# Altium project main_pcb.PrjPcb
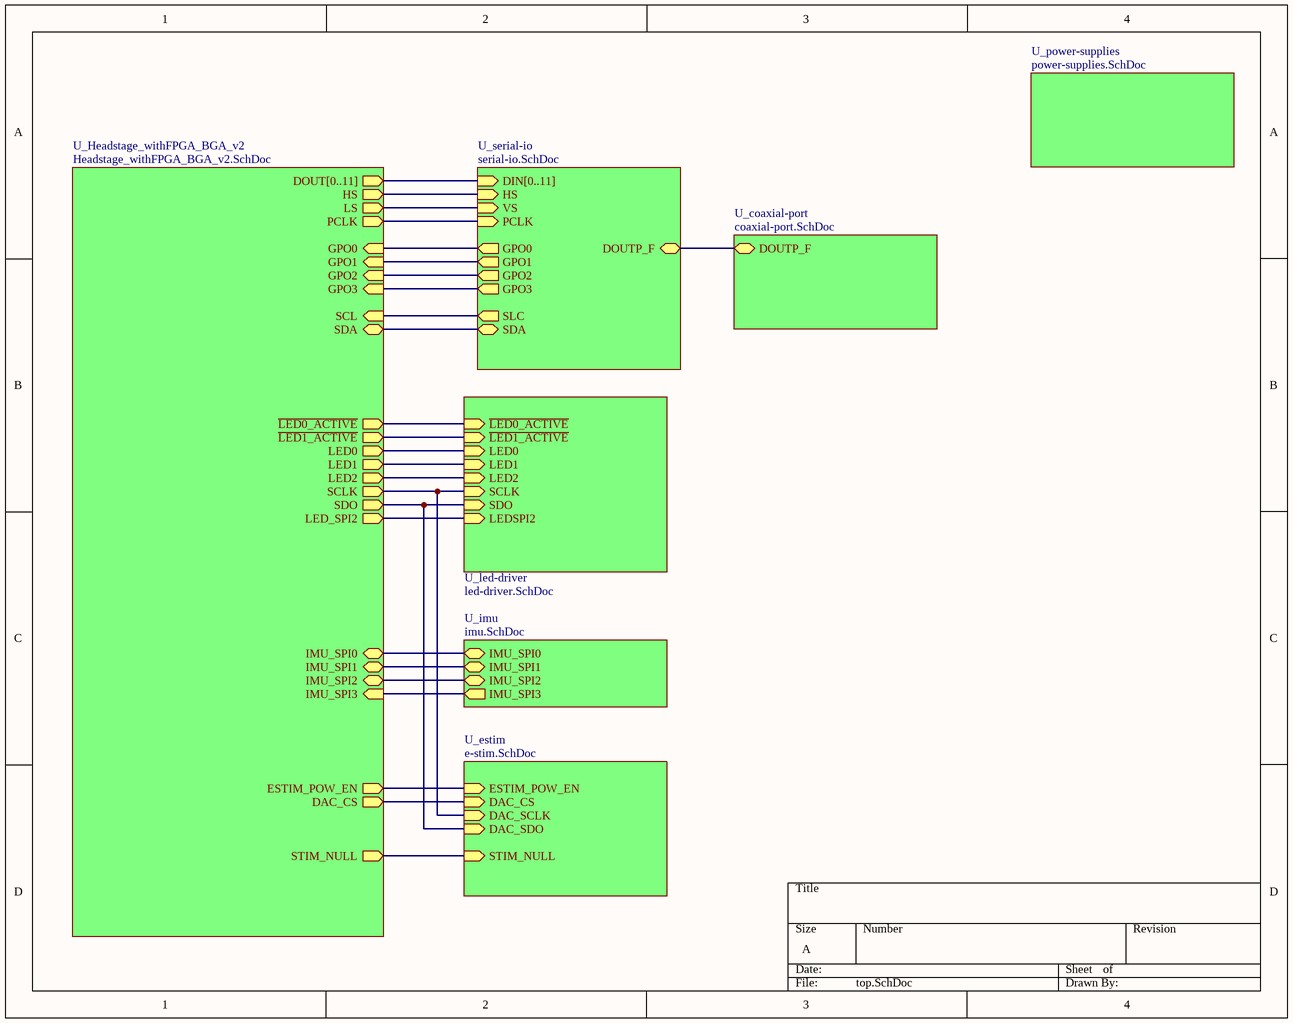
[diagram p0: top.SchDoc]
7 sheets, 112 parts. Net scope: hierarchical (ports join the sheet entries above them; power ports are global).
Board file: serdes-interface.PcbDoc
Sheets:
  top.SchDoc
    U_coaxial-port = coaxial-port.SchDoc
    U_power-supplies = power-supplies.SchDoc
    U_serial-io = serial-io.SchDoc
    U_led-driver = led-driver.SchDoc
    U_imu = imu.SchDoc
    U_estim = e-stim.SchDoc

## Sheet top.SchDoc
size A

### Sub-sheets
U_coaxial-port = coaxial-port.SchDoc: DOUTP_F (bidir)
U_estim = e-stim.SchDoc: ESTIM_POW_EN (in), DAC_CS (in), DAC_SCLK (in), DAC_SDO (in), STIM_NULL (in)
U_Headstage_withFPGA_BGA_v2 = Headstage_withFPGA_BGA_v2.SchDoc (file not in this document): DOUT[0..11] (out), HS (out), LS (out), PCLK (out), GPO3 (in), GPO2 (in), GPO1 (in), SDA (bidir), SCL (in), GPO0 (in), ~{LED0_ACTIVE} (out), ~{LED1_ACTIVE} (out), LED0 (out), LED1 (out), LED2 (out), SCLK (out), SDO (out), LED_SPI2 (out), IMU_SPI0 (bidir), IMU_SPI1 (bidir), IMU_SPI2 (bidir), IMU_SPI3 (in), ESTIM_POW_EN (out), DAC_CS (out), STIM_NULL (out)
U_imu = imu.SchDoc: IMU_SPI0 (bidir), IMU_SPI1 (bidir), IMU_SPI2 (bidir), IMU_SPI3 (out)
U_led-driver = led-driver.SchDoc: ~{LED0_ACTIVE} (in), ~{LED1_ACTIVE} (in), SCLK (in), LED0 (in), LED1 (in), LED2 (in), SDO (in), LEDSPI2 (in)
U_power-supplies = power-supplies.SchDoc: no entries
U_serial-io = serial-io.SchDoc: DIN[0..11] (in), HS (in), VS (in), PCLK (in), DOUTP_F (bidir), SDA (bidir), SLC (out), GPO0 (out), GPO1 (out), GPO2 (out), GPO3 (out)

### Nets
IMU_SPI0: sheet U_Headstage_withFPGA_BGA_v2/IMU_SPI0, sheet U_imu/IMU_SPI0
IMU_SPI1: sheet U_Headstage_withFPGA_BGA_v2/IMU_SPI1, sheet U_imu/IMU_SPI1
IMU_SPI2: sheet U_Headstage_withFPGA_BGA_v2/IMU_SPI2, sheet U_imu/IMU_SPI2
IMU_SPI3: sheet U_Headstage_withFPGA_BGA_v2/IMU_SPI3, sheet U_imu/IMU_SPI3
LED0: sheet U_Headstage_withFPGA_BGA_v2/LED0, sheet U_led-driver/LED0
LED1: sheet U_Headstage_withFPGA_BGA_v2/LED1, sheet U_led-driver/LED1
LED2: sheet U_Headstage_withFPGA_BGA_v2/LED2, sheet U_led-driver/LED2
LEDSPI2: sheet U_Headstage_withFPGA_BGA_v2/LED_SPI2, sheet U_led-driver/LEDSPI2
NetC18_1: sheet U_coaxial-port/DOUTP_F, sheet U_serial-io/DOUTP_F
NetDAC1_1: sheet U_Headstage_withFPGA_BGA_v2/DAC_CS, sheet U_estim/DAC_CS
NetDAC1_2: sheet U_Headstage_withFPGA_BGA_v2/SCLK, sheet U_led-driver/SCLK, sheet U_estim/DAC_SCLK
NetDAC1_3: sheet U_Headstage_withFPGA_BGA_v2/SDO, sheet U_led-driver/SDO, sheet U_estim/DAC_SDO
NetLD1_21: sheet U_Headstage_withFPGA_BGA_v2/~{LED0_ACTIVE}, sheet U_led-driver/~{LED0_ACTIVE}
NetLD2_21: sheet U_Headstage_withFPGA_BGA_v2/~{LED1_ACTIVE}, sheet U_led-driver/~{LED1_ACTIVE}
NetPWR15_8: sheet U_Headstage_withFPGA_BGA_v2/ESTIM_POW_EN, sheet U_estim/ESTIM_POW_EN
NetR7_1: sheet U_serial-io/SDA, sheet U_Headstage_withFPGA_BGA_v2/SDA
NetR8_1: sheet U_serial-io/SLC, sheet U_Headstage_withFPGA_BGA_v2/SCL
NetR46_2: sheet U_Headstage_withFPGA_BGA_v2/STIM_NULL, sheet U_estim/STIM_NULL
NetU9_1: sheet U_serial-io/HS, sheet U_Headstage_withFPGA_BGA_v2/HS
NetU9_2: sheet U_serial-io/VS, sheet U_Headstage_withFPGA_BGA_v2/LS
NetU9_3: sheet U_serial-io/PCLK, sheet U_Headstage_withFPGA_BGA_v2/PCLK
NetU9_15: sheet U_serial-io/GPO0, sheet U_Headstage_withFPGA_BGA_v2/GPO0
NetU9_16: sheet U_serial-io/GPO1, sheet U_Headstage_withFPGA_BGA_v2/GPO1
NetU9_17: sheet U_serial-io/GPO2, sheet U_Headstage_withFPGA_BGA_v2/GPO2
NetU9_18: sheet U_serial-io/GPO3, sheet U_Headstage_withFPGA_BGA_v2/GPO3

### Buses and harness runs
bus sheet U_Headstage_withFPGA_BGA_v2/DOUT[0..11] = sheet U_serial-io/DIN[0..11]

## Sheet coaxial-port.SchDoc
size A
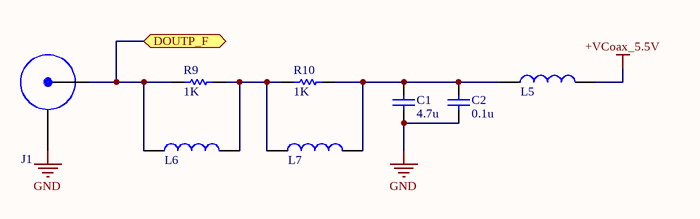
[diagram p1: coaxial-port.SchDoc]

### Parts
C1  value 4.7u  [Cap-0603]  (hidden comment: X7R Ceramic)
C2  value 0.1u  [Cap-0603]  (hidden comment: X7R Ceramic)
J1  Coax Connector  [SMA_132134-10-ND]  (value not drawn)
L5  Ferrite Bead  [BLM18KG601SN1D]  (value not drawn)
L6  Ferrite Bead  [CIG21L4R7MNE]  (value not drawn)
L7  Ferrite Bead  [CBC3225T101MR]  (value not drawn)
R9  value 1K  [Res_0402]  (hidden comment: Res1)
R10  value 1K  [Res_0402]  (hidden comment: Res1)

### Ports
DOUTP_F (bidir)

### Nets
+VCoax_5.5V: L5.2
GND: C1.1 C2.1 J1.1
NetC1_2: C1.2 C2.2 L5.1 L7.2 R10.1
NetC18_1: J1.0 L6.1 R9.2 ; port DOUTP_F
NetL6_2: L6.2 L7.1 R9.1 R10.2

### Library data of the parts
C1 C2 = Cap: Capacitor; Published: 8-Jun-2000; LatestRevisionDate: 17-Jul-2002; LatestRevisionNote: Re-released for DXP Platform.; PackageReference: RAD-0.3; Publisher: Altium Limited; PackageDescription: Radial Cap, Thru-Hole; 2 Leads; 0.3 in Pin Spacing
R9 R10 = Res1: Resistor; Published: 8-Jun-2000; LatestRevisionDate: 17-Jul-2002; LatestRevisionNote: Re-released for DXP Platform.; PackageReference: AXIAL-0.3; Publisher: Altium Limited; PackageDescription: Axial Device, Thru-Hole; 2 Leads; 0.3 in Pin Spacing

## Sheet power-supplies.SchDoc
size B
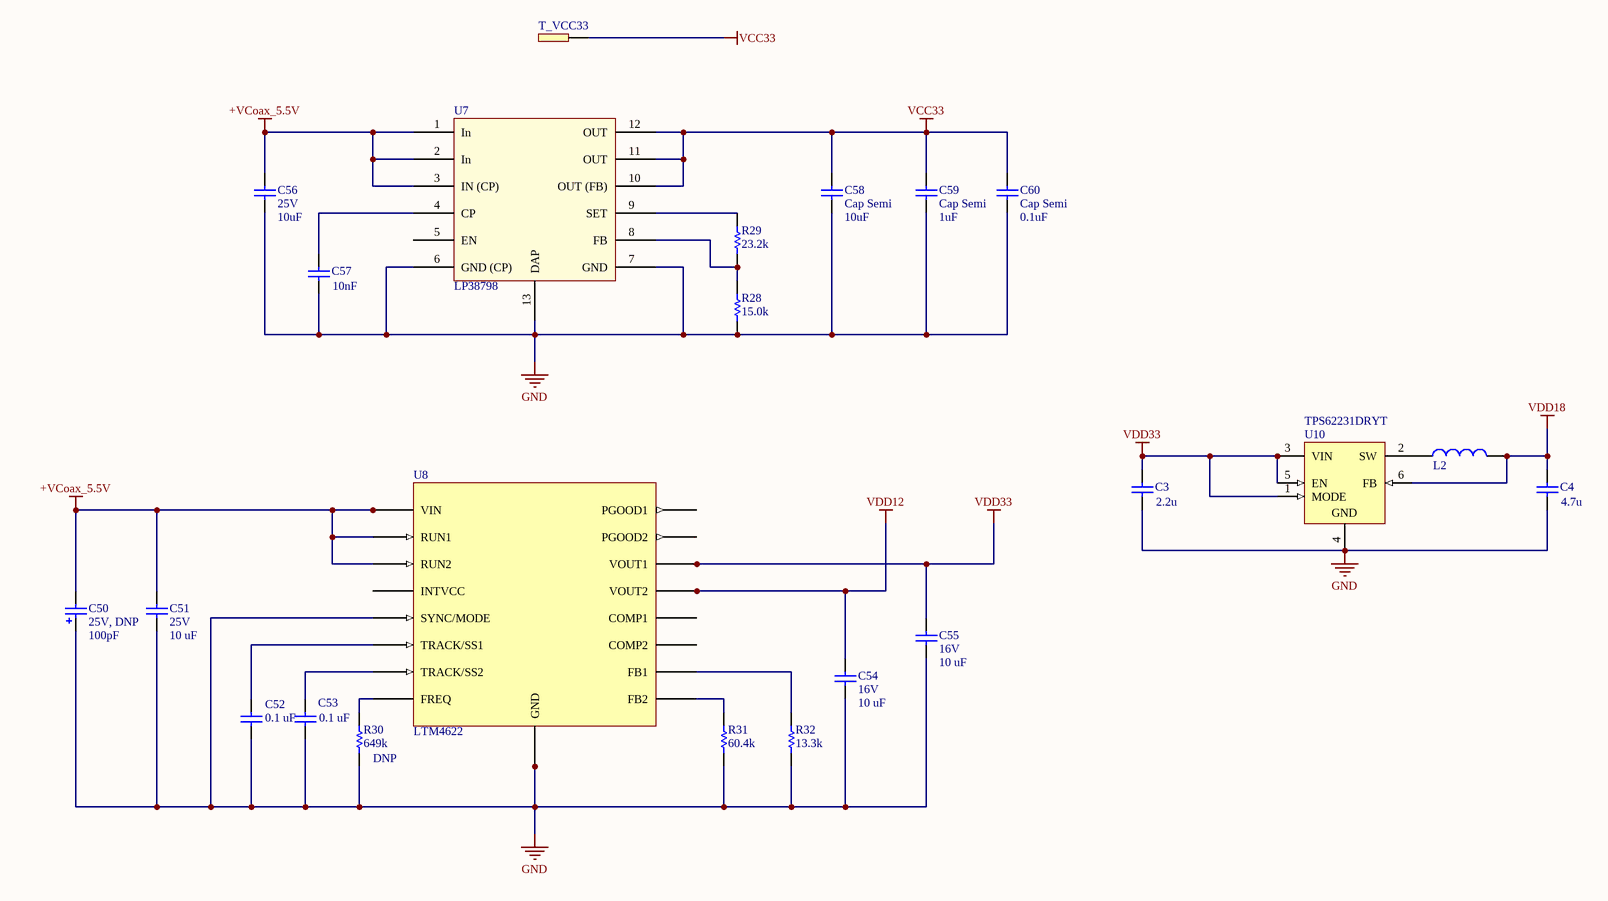
[diagram p2: power-supplies.SchDoc]

### Parts
C3  value 2.2u  [Cap_0402]  (hidden comment: X7R Ceramic)
C4  value 4.7u  [Cap_0402]  (hidden comment: X7R Ceramic)
C50  25V, DNP  value 100pF  [C0805]
C51  25V  value 10 uF  [C1206]
C52  value 0.1 uF  [C1206]  (hidden comment: 25V)
C53  value 0.1 uF  [C1206]  (hidden comment: 25V)
C54  16V  value 10 uF  [C1206]
C55  16V  value 10 uF  [C1206]
C56  25V  value 10uF  [C1206]
C57  value 10nF  [0402]
C58  Cap Semi  value 10uF  [Cap-0603]
C59  Cap Semi  value 1uF  [Cap-0603]
C60  Cap Semi  value 0.1uF  [Cap-0603]
L2  Ferrite Bead  [LQM21PN2R2MC0D]  (value not drawn)
R28  value 15.0k  [Res_0402]  (hidden comment: Res1)
R29  value 23.2k  [Res_0402]  (hidden comment: Res1)
R30  DNP  value 649k  [Res_0402]
R31  value 60.4k  [Res_0402]  (hidden comment: 649k (DNP))
R32  value 13.3k  [Res_0402]
T_VCC33  Header_1PIN  [JUMPER1PIN]  (value not drawn)
U7  LP38798  [DFN12]
U8  LTM4622  [LGA5x5]
U10  TPS62231DRYT  [TPS62231DRYT]

### Nets
+VCoax_5.5V: C50.2 C51.2 C56.2 U7.1(In) U7.2(In) U7.3(IN_(CP)) U8.A2(VIN) U8.B2(RUN2) U8.B3(VIN) U8.D2(RUN1) U8.D3(VIN) U8.E2(VIN)
GND: C3.1 C4.1 C50.1 C51.1 C52.1 C53.1 C54.1 C55.1 C56.1 C57.1 C58.1 C59.1 C60.1 R28.2 R30.2 R31.2 R32.2 U7.6(GND_(CP)) U7.7(GND) U7.13(DAP) U8.B5(GND) U8.C1(GND) U8.C2(GND) U8.C5(SYNC/MODE) U8.D5(GND) U10.4(GND)
VCC33: C58.2 C59.2 C60.2 T_VCC33.0 U7.10(OUT_(FB)) U7.11(OUT) U7.12(OUT)
VDD12: C54.2 U8.A1(VOUT2) U8.B1(VOUT2)
VDD18: C4.2 L2.2 U10.6(FB)
VDD33: C3.2 C55.2 U8.D1(VOUT1) U8.E1(VOUT1) U10.1(MODE) U10.3(VIN) U10.5(EN)
NetC52_2: C52.2 U8.E5(TRACK/SS1)
NetC53_2: C53.2 U8.A3(TRACK/SS2)
NetC57_2: C57.2 U7.4(CP)
NetL2_1: L2.1 U10.2(SW)
NetR28_1: R28.1 R29.2 U7.8(FB)
NetR29_1: R29.1 U7.9(SET)
NetR30_1: R30.1 U8.C4(FREQ)
NetR31_1: R31.1 U8.A4(FB2)
NetR32_1: R32.1 U8.E4(FB1)

Not connected (* = marked no-connect by the designer): U7 5(EN); U8 A5(COMP2) B4(PGOOD2) C3(INTVCC) D4(PGOOD1)

### Library data of the parts
C3 C4 = Cap: Capacitor; Published: 8-Jun-2000; LatestRevisionDate: 17-Jul-2002; LatestRevisionNote: Re-released for DXP Platform.; PackageReference: RAD-0.3; Publisher: Altium Limited; PackageDescription: Radial Cap, Thru-Hole; 2 Leads; 0.3 in Pin Spacing
C50 = Cap Pol3: Polarized Capacitor (Surface Mount); Published: 8-Jun-2000; LatestRevisionDate: 29-May-2009; LatestRevisionNote: IPC-7351 Footprint Added.; PackageReference: C0805; Publisher: Altium Limited; PackageDescription: Chip Capacitor
C51-C60 = Cap Semi: Capacitor (Semiconductor SIM Model); Published: 8-Jun-2000; LatestRevisionDate: 29-May-2009; LatestRevisionNote: IPC-7351 Footprint Added.; PackageReference: C1206; Publisher: Altium Limited; PackageDescription: Chip Capacitor
  C51-C53: Voltage: 25 V
  C54 C55: Voltage: 16 V
R28-R32 = Res1: Resistor; Published: 8-Jun-2000; LatestRevisionDate: 17-Jul-2002; LatestRevisionNote: Re-released for DXP Platform.; PackageReference: AXIAL-0.3; Publisher: Altium Limited; PackageDescription: Axial Device, Thru-Hole; 2 Leads; 0.3 in Pin Spacing
U7 = Component_1: Low Noise Positive LDO
U10 = TPS62231DRYT: Buck Step Down Regulator with 2.05 to 6 V Input and 1.8 V Output, -40 to 85 degC, 6-Pin SON (DRY), Green (RoHS & no Sb/Br); Manufacturer: Texas Instruments; Duty Cycle(Max)(%): 100; Iout(Max)(A): 0.5; Iq(Typ)(mA): 0.022; Preset Vout(V): 1.8; Rating: Catalog; Regulated Outputs(#): 1; SubFamily: Step-Down Regulator; Switch Current Limit(Typ)(A): 0.84; Synchronous Rectification: TRUE; Vin(Max)(V): 6; Vin(Min)(V): 2.05; DatasheetVersion: SLVS941E; PackageVersion: revF, Dec-2011; PackageReference: DRY6; PackageDescription: 6-Pin Plastic Small Outline No-Lead, 1 x 1.45 x 0.6 mm Body, 0.5 mm Pitch; Supplier 1: Digi-Key; Supplier Part Number 1: 296-24485-2-ND; Supplier 2: Digi-Key; Supplier Part Number 2: 296-24485-1-ND; Supplier 3: Digi-Key; Supplier Part Number 3: 296-24485-6-ND; Supplier 4: Farnell; Supplier Part Number 4: 1735598; Supplier 5: Newark; Supplier Part Number 5: 07R8108; Supplier 6: Mouser; Supplier Part Number 6: 595-TPS62231DRYT; Eco-Plan: Green (RoHS & no Sb/Br); Topology: Buck; Vout(Max)(V): 1.8; Vout(Min)(V): 1.8; Mounting Technology: Surface Mount; PartNumber: TPS62231DRYT; ComponentLink1Description: Datasheet; ComponentLink1URL: http://www.ti.com/general/docs/lit/getliterature.tsp?genericPartNumber=TPS62231&fileType=pdf; ComponentLink2Description: Package Specification; ComponentLink2URL: http://www.ti.com/litv/pdf/mpds221e; ComponentLink3Description: URL Link1; ComponentLink3URL: Samples URL:http://www.ti.com/product/tps62231#samples

## Sheet serial-io.SchDoc
size A
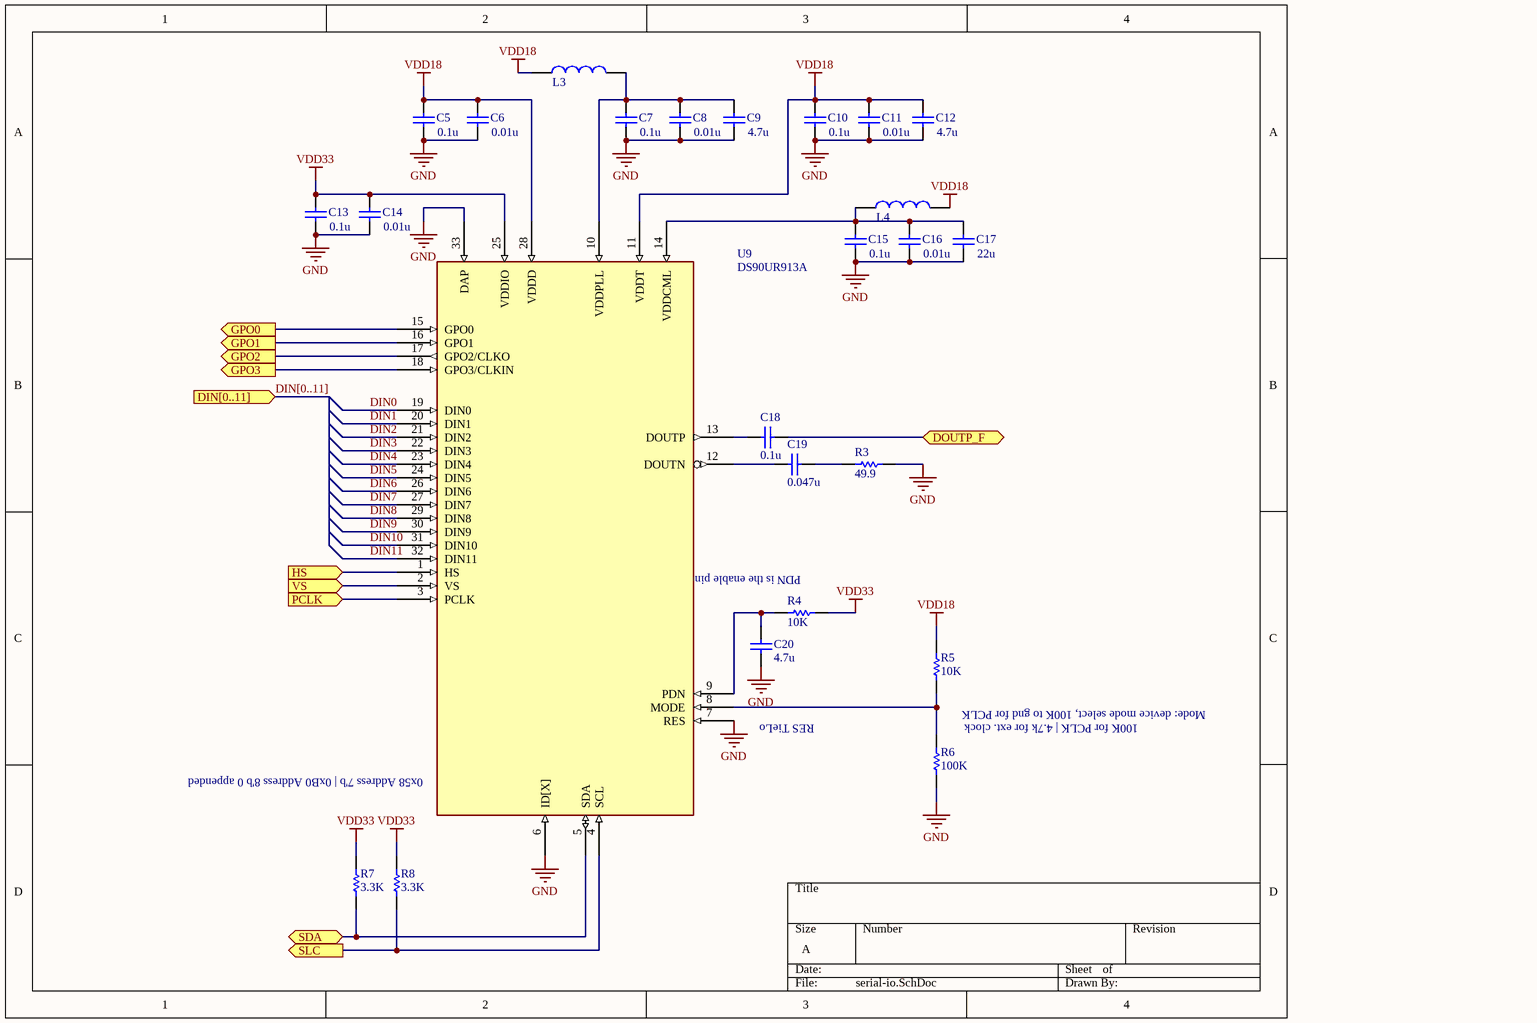
[diagram p3: serial-io.SchDoc]

### Parts
C5  value 0.1u  [Cap_0402]  (hidden comment: X7R Ceramic)
C6  value 0.01u  [Cap_0402]  (hidden comment: X7R Ceramic)
C7  value 0.1u  [Cap_0402]  (hidden comment: X7R Ceramic)
C8  value 0.01u  [Cap_0402]  (hidden comment: X7R Ceramic)
C9  value 4.7u  [Cap_0402]  (hidden comment: X7R Ceramic)
C10  value 0.1u  [Cap_0402]  (hidden comment: X7R Ceramic)
C11  value 0.01u  [Cap_0402]  (hidden comment: X7R Ceramic)
C12  value 4.7u  [Cap_0402]  (hidden comment: X7R Ceramic)
C13  value 0.1u  [Cap_0402]  (hidden comment: X7R Ceramic)
C14  value 0.01u  [Cap_0402]  (hidden comment: X7R Ceramic)
C15  value 0.1u  [Cap_0402]  (hidden comment: X7R Ceramic)
C16  value 0.01u  [Cap_0402]  (hidden comment: X7R Ceramic)
C17  value 22u  [Cap-0603]  (hidden comment: X7R Ceramic)
C18  value 0.1u  [Cap_0402]  (hidden comment: X7R Ceramic)
C19  value 0.047u  [Cap_0402]  (hidden comment: X7R Ceramic)
C20  value 4.7u  [Cap_0402]  (hidden comment: X7R Ceramic)
L3  Ferrite Bead  [BLM18KG601SN1D]  (value not drawn)
L4  Ferrite Bead  [BLM18KG601SN1D]  (value not drawn)
R3  value 49.9  [Res_0402]  (hidden comment: Res1)
R4  value 10K  [Res_0402]  (hidden comment: Res1)
R5  value 10K  [Res_0402]  (hidden comment: Res1)
R6  value 100K  [Res_0402]  (hidden comment: Res1)
R7  value 3.3K  [Res_0402]  (hidden comment: Res1)
R8  value 3.3K  [Res_0402]  (hidden comment: Res1)
U9  DS90UR913A  [WQFN32-DS90UB913A]

### Ports
DIN[0..11] (in), DOUTP_F (bidir), GPO0 (out), GPO1 (out), GPO2 (out), GPO3 (out), HS (in), PCLK (in), SDA (bidir), SLC (out), VS (in)

### Nets
GND: C5.1 C6.1 C7.1 C8.1 C9.1 C10.1 C11.1 C12.1 C13.1 C14.1 C15.1 C16.1 C17.1 C20.1 R3.2 R6.1 U9.6(ID[X]) U9.7(RES) U9.33(DAP)
VDD18: C5.2 C6.2 C10.2 C11.2 C12.2 L3.1 L4.2 R5.2 U9.11(VDDT) U9.28(VDDD)
VDD33: C13.2 C14.2 R4.2 R7.2 R8.2 U9.25(VDDIO)
DIN0: U9.19(DIN0)
DIN1: U9.20(DIN1)
DIN2: U9.21(DIN2)
DIN3: U9.22(DIN3)
DIN4: U9.23(DIN4)
DIN5: U9.24(DIN5)
DIN6: U9.26(DIN6)
DIN7: U9.27(DIN7)
DIN8: U9.29(DIN8)
DIN9: U9.30(DIN9)
DIN10: U9.31(DIN10)
DIN11: U9.32(DIN11)
NetC7_2: C7.2 C8.2 C9.2 L3.2 U9.10(VDDPLL)
NetC15_2: C15.2 C16.2 C17.2 L4.1 U9.14(VDDCML)
NetC18_1: C18.1 ; port DOUTP_F
NetC18_2: C18.2 U9.13(DOUTP)
NetC19_1: C19.1 R3.1
NetC19_2: C19.2 U9.12(DOUTN)
NetC20_2: C20.2 R4.1 U9.9(PDN)
NetR5_1: R5.1 R6.2 U9.8(MODE)
NetR7_1: R7.1 U9.5(SDA) ; port SDA
NetR8_1: R8.1 U9.4(SCL) ; port SLC
NetU9_1: U9.1(HS) ; port HS
NetU9_2: U9.2(VS) ; port VS
NetU9_3: U9.3(PCLK) ; port PCLK
NetU9_15: U9.15(GPO0) ; port GPO0
NetU9_16: U9.16(GPO1) ; port GPO1
NetU9_17: U9.17(GPO2/CLKO) ; port GPO2
NetU9_18: U9.18(GPO3/CLKIN) ; port GPO3

### Buses and harness runs
bus DIN[0..11] = port DIN[0..11]

### Notes on the sheet
- (near U9) PDN is the enable pin
- Mode: device mode select, 100K to gnd for PCLK
- (near U9) 0x58 Address 7'b | 0xB0 Address 8'b 0 appended
- RES TieLo
- (near R6) 100K for PCLK | 4.7k for ext. clock

### Library data of the parts
C5-C20 = Cap: Capacitor; Published: 8-Jun-2000; LatestRevisionDate: 17-Jul-2002; LatestRevisionNote: Re-released for DXP Platform.; PackageReference: RAD-0.3; Publisher: Altium Limited; PackageDescription: Radial Cap, Thru-Hole; 2 Leads; 0.3 in Pin Spacing
R3-R8 = Res1: Resistor; Published: 8-Jun-2000; LatestRevisionDate: 17-Jul-2002; LatestRevisionNote: Re-released for DXP Platform.; PackageReference: AXIAL-0.3; Publisher: Altium Limited; PackageDescription: Axial Device, Thru-Hole; 2 Leads; 0.3 in Pin Spacing
U9 = DS90UR913A: DS90UR913ASERIALIZER

## Sheet led-driver.SchDoc
size A
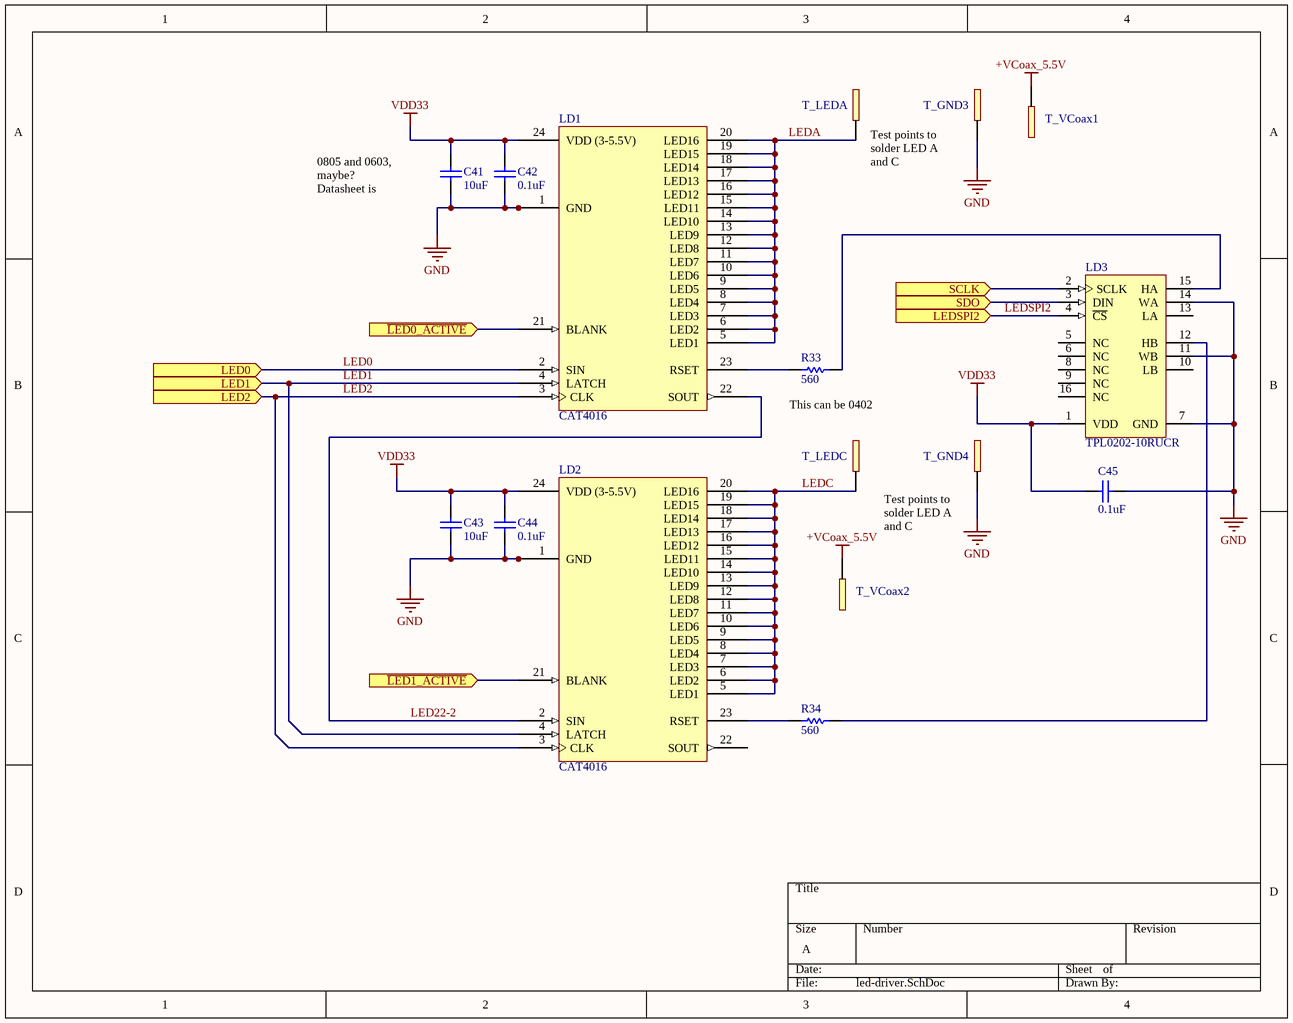
[diagram p4: led-driver.SchDoc]

### Parts
C41  value 10uF  [Cap-0603]  (hidden comment: Cap)
C42  value 0.1uF  [Cap_0402]  (hidden comment: Cap)
C43  value 10uF  [Cap-0603]  (hidden comment: Cap)
C44  value 0.1uF  [Cap_0402]  (hidden comment: Cap)
C45  value 0.1uF  [Cap_0402]  (hidden comment: Cap)
LD1  CAT4016  [TQFN24-4x4mm]
LD2  CAT4016  [TQFN24-4x4mm]
LD3  TPL0202-10RUCR  [WQFN16-3X3mm]
R33  value 560  [Res_0402]  (hidden comment: Res1)
R34  value 560  [Res_0402]  (hidden comment: Res1)
T_GND3  Header_1PIN  [JUMPER1PIN]  (value not drawn)
T_GND4  Header_1PIN  [JUMPER1PIN]  (value not drawn)
T_LEDA  Header_1PIN  [JUMPER1PIN]  (value not drawn)
T_LEDC  Header_1PIN  [JUMPER1PIN]  (value not drawn)
T_VCoax1  Header_1PIN  [JUMPER1PIN]  (value not drawn)
T_VCoax2  Header_1PIN  [JUMPER1PIN]  (value not drawn)

### Ports
LED0 (in), LED1 (in), LED2 (in), LEDSPI2 (in), SCLK (in), SDO (in), ~{LED0_ACTIVE} (in), ~{LED1_ACTIVE} (in)

### Nets
+VCoax_5.5V: T_VCoax1.0 T_VCoax2.0
GND: C41.1 C42.1 C43.1 C44.1 C45.2 LD1.1(GND) LD1.PAD LD2.1(GND) LD2.PAD LD3.7(GND) LD3.11(WB) LD3.14(WA) T_GND3.0 T_GND4.0
VDD33: C41.2 C42.2 C43.2 C44.2 C45.1 LD1.24(VDD_(3-5.5V)) LD2.24(VDD_(3-5.5V)) LD3.1(VDD)
LED0: LD1.2(SIN) ; port LED0
LED1: LD1.4(LATCH) LD2.4(LATCH) ; port LED1
LED2: LD1.3(CLK) LD2.3(CLK) ; port LED2
LED22-2: LD1.22(SOUT) LD2.2(SIN)
LEDA: LD1.5(LED1) LD1.6(LED2) LD1.7(LED3) LD1.8(LED4) LD1.9(LED5) LD1.10(LED6) LD1.11(LED7) LD1.12(LED8) LD1.13(LED9) LD1.14(LED10) LD1.15(LED11) LD1.16(LED12) LD1.17(LED13) LD1.18(LED14) LD1.19(LED15) LD1.20(LED16) T_LEDA.0
LEDC: LD2.5(LED1) LD2.6(LED2) LD2.7(LED3) LD2.8(LED4) LD2.9(LED5) LD2.10(LED6) LD2.11(LED7) LD2.12(LED8) LD2.13(LED9) LD2.14(LED10) LD2.15(LED11) LD2.16(LED12) LD2.17(LED13) LD2.18(LED14) LD2.19(LED15) LD2.20(LED16) T_LEDC.0
LEDSPI2: LD3.4(~{CS}) ; port LEDSPI2
NetDAC1_2: LD3.2(SCLK) ; port SCLK
NetDAC1_3: LD3.3(DIN) ; port SDO
NetLD1_21: LD1.21(BLANK) ; port ~{LED0_ACTIVE}
NetLD1_23: LD1.23(RSET) R33.2
NetLD2_21: LD2.21(BLANK) ; port ~{LED1_ACTIVE}
NetLD2_23: LD2.23(RSET) R34.2
NetLD3_12: LD3.12(HB) R34.1
NetLD3_15: LD3.15(HA) R33.1

Not connected (* = marked no-connect by the designer): LD2 22(SOUT); LD3 5(NC) 6(NC) 8(NC) 9(NC) 10(LB) 13(LA) 16(NC)

### Notes on the sheet
- Test points to solder LED A and C
- (near C41) 0805 and 0603, maybe? Datasheet is lacking...
- (near R33) This can be 0402

### Library data of the parts
C41-C45 = Cap: Capacitor; Published: 8-Jun-2000; LatestRevisionDate: 17-Jul-2002; LatestRevisionNote: Re-released for DXP Platform.; PackageReference: RAD-0.3; Publisher: Altium Limited; PackageDescription: Radial Cap, Thru-Hole; 2 Leads; 0.3 in Pin Spacing
LD1 LD2 = CAT4016: 16-Channel Constant Current LED Driver
LD3 = TPL0202-10RUCR: 256 Tap, Dual Channel Digital Potentiometer with SPI Interface and Non-Volatile Memory, -40 to 85 degC, 14-pin QFN (RUC14); Manufacturer: Texas Instruments; DAC Channels: 2; DNL(Max)(+/-LSB): 0.5; INL(Max)(+/-LSB): 1; DatasheetVersion: SLIS135C; PackageVersion: 4208447/C, 08/2008; PackageReference: RUC14; PackageDescription: 14-Pin Plastic Quad Flatpack No-Lead, Body 2 x 2 mm, Pitch 0.4 mm; Supplier 1: Mouser; Supplier Part Number 1: N/A; Interface: SPI; SubFamily: Digital Potentiometer; Mounting Technology: Surface Mount; Code_JEDEC: MO-288; PartNumber: TPL0202-10RUCR; ComponentLink1Description: Manufacturer URL; ComponentLink1URL: http://www.ti.com/; ComponentLink2Description: Datasheet; ComponentLink2URL: http://www.ti.com/general/docs/lit/getliterature.tsp?genericPartNumber=TPL0202-10&fileType=pdf; ComponentLink3Description: Package Specification; ComponentLink3URL: http://www.ti.com/lit/ml/mpqf212b/mpqf212b.pdf
R33 R34 = Res1: Resistor; Published: 8-Jun-2000; LatestRevisionDate: 17-Jul-2002; LatestRevisionNote: Re-released for DXP Platform.; PackageReference: AXIAL-0.3; Publisher: Altium Limited; PackageDescription: Axial Device, Thru-Hole; 2 Leads; 0.3 in Pin Spacing

## Sheet imu.SchDoc
size A
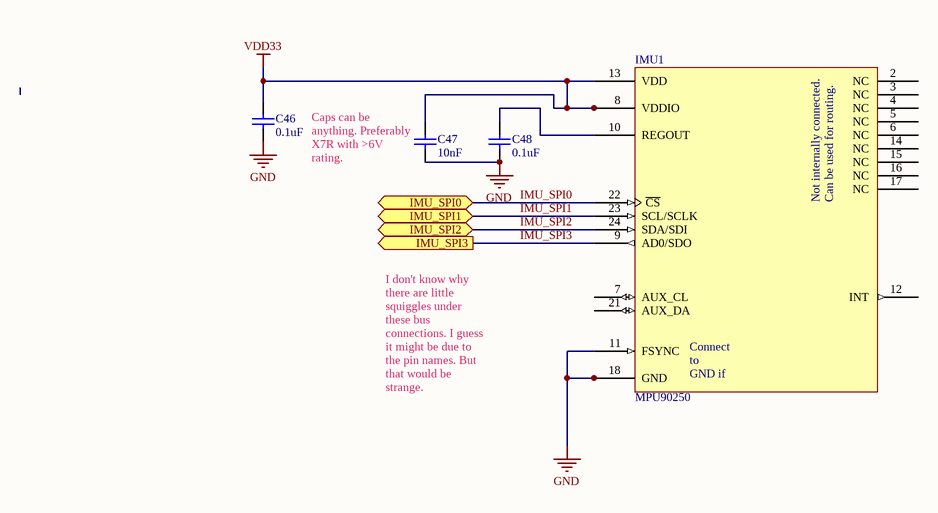
[diagram p5: imu.SchDoc]

### Parts
C46  value 0.1uF  [Cap_0402]  (hidden comment: Cap)
C47  value 10nF  [Cap_0402]  (hidden comment: Cap)
C48  value 0.1uF  [Cap_0402]  (hidden comment: Cap)
IMU1  MPU90250  [QFN24-3x3mm]

### Ports
IMU_SPI0 (bidir), IMU_SPI1 (bidir), IMU_SPI2 (bidir), IMU_SPI3 (out)

### Nets
GND: C46.2 C47.2 C48.2 IMU1.11(FSYNC) IMU1.18(GND) IMU1.20(RESV)
VDD33: C46.1 C47.1 IMU1.1(RESV) IMU1.8(VDDIO) IMU1.13(VDD)
IMU_SPI0: IMU1.22(~{CS}) ; port IMU_SPI0
IMU_SPI1: IMU1.23(SCL/SCLK) ; port IMU_SPI1
IMU_SPI2: IMU1.24(SDA/SDI) ; port IMU_SPI2
IMU_SPI3: IMU1.9(AD0/SDO) ; port IMU_SPI3
NetC48_1: C48.1 IMU1.10(REGOUT)

Not connected (* = marked no-connect by the designer): IMU1 2(NC) 3(NC) 4(NC) 5(NC) 6(NC) 7(AUX_CL) 12(INT) 14(NC) 15(NC) 16(NC) 17(NC) 19(DO_NOT_CONNECT) 21(AUX_DA)

### Notes on the sheet
- (near C47) Caps can be anything. Preferably X7R with >6V rating.
- I don't know why there are little squiggles under these bus connections. I guess it might be due to the pin names. But that would be strange.
- (in symbol MPU90250) Not internally connected.; Can be used for routing.; Connect to / GND if / not in use

### Library data of the parts
C46-C48 = Cap: Capacitor; Published: 8-Jun-2000; LatestRevisionDate: 17-Jul-2002; LatestRevisionNote: Re-released for DXP Platform.; PackageReference: RAD-0.3; Publisher: Altium Limited; PackageDescription: Radial Cap, Thru-Hole; 2 Leads; 0.3 in Pin Spacing
IMU1 = MPU90250: 9-Axis IMU (Accel, Gyro, Magno)

## Sheet e-stim.SchDoc
size C
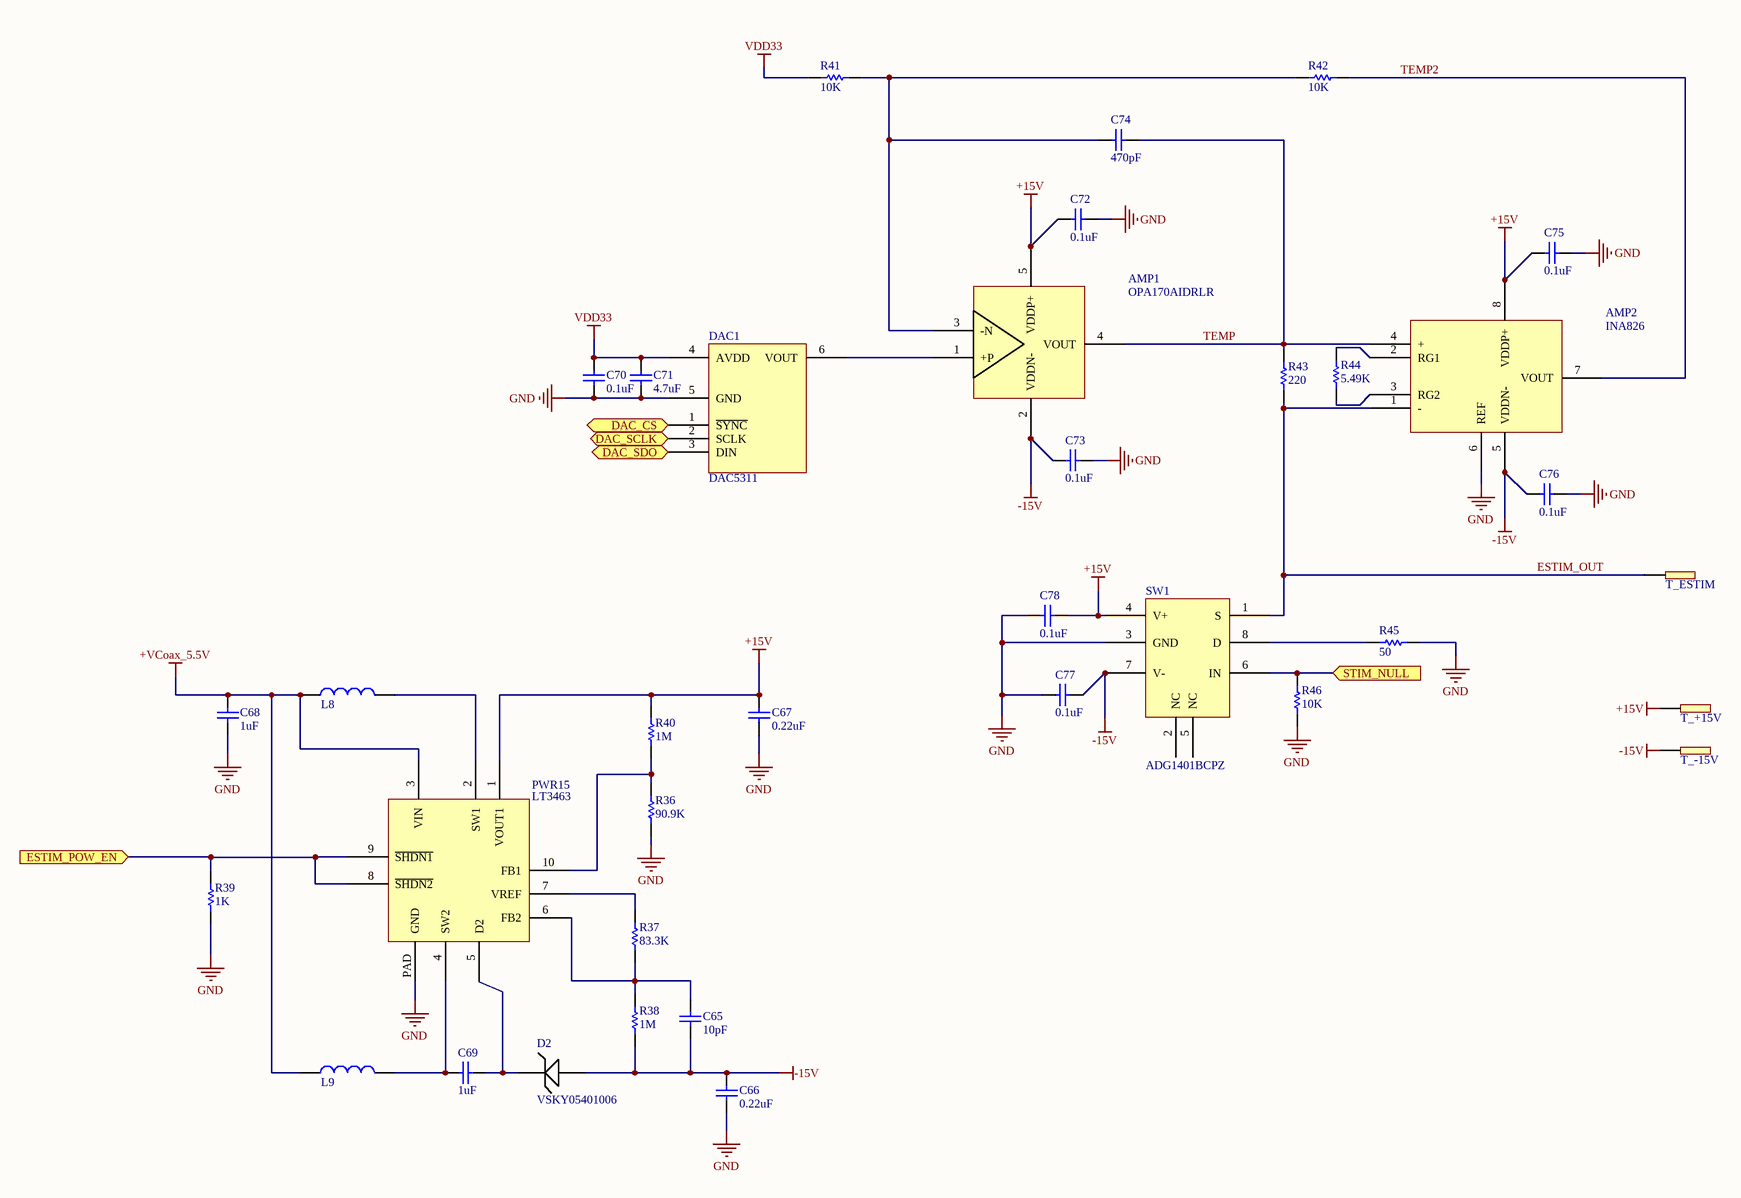
[diagram p6: e-stim.SchDoc]

### Parts
AMP1  OPA170AIDRLR  [OPA170-DRL]
AMP2  INA826  [INA826AIDRGR]
C65  value 10pF  [Cap-0603]  (hidden comment: X7R Ceramic)
C66  value 0.22uF  [Cap-0603]  (hidden comment: X7R Ceramic)
C67  value 0.22uF  [Cap-0603]  (hidden comment: X7R Ceramic)
C68  value 1uF  [Cap-0603]  (hidden comment: X7R Ceramic)
C69  value 1uF  [Cap-0603]  (hidden comment: X7R Ceramic)
C70  value 0.1uF  [Cap_0402]  (hidden comment: X7R Ceramic)
C71  value 4.7uF  [Cap_0402]  (hidden comment: X7R Ceramic)
C72  value 0.1uF  [Cap_0402]  (hidden comment: X7R Ceramic)
C73  value 0.1uF  [Cap_0402]  (hidden comment: X7R Ceramic)
C74  value 470pF  [Cap_0402]  (hidden comment: X7R Ceramic)
C75  value 0.1uF  [Cap_0402]  (hidden comment: X7R Ceramic)
C76  value 0.1uF  [Cap_0402]  (hidden comment: X7R Ceramic)
C77  value 0.1uF  [Cap_0402]  (hidden comment: X7R Ceramic)
C78  value 0.1uF  [Cap_0402]  (hidden comment: X7R Ceramic)
D2  VSKY05401006  [Cap_0402]
DAC1  DAC5311  [DAC5311]
L8  Ferrite Bead  [MLZ2012M100WT000]  (value not drawn)
L9  Ferrite Bead  [MLZ2012M100WT000]  (value not drawn)
PWR15  LT3463  [LT3463]
R36  value 90.9K  [Res_0402]  (hidden comment: Res1)
R37  value 83.3K  [Res_0402]  (hidden comment: Res1)
R38  value 1M  [Res_0402]  (hidden comment: Res1)
R39  value 1K  [Res_0402]  (hidden comment: Res1)
R40  value 1M  [Res_0402]  (hidden comment: Res1)
R41  value 10K  [Res_0402]  (hidden comment: Res1)
R42  value 10K  [Res_0402]  (hidden comment: Res1)
R43  value 220  [Res_0402]  (hidden comment: Res1)
R44  value 5.49K  [Res_0402]  (hidden comment: Res1)
R45  value 50  [Res_0402]  (hidden comment: Res1)
R46  value 10K  [Res_0402]  (hidden comment: Res1)
SW1  ADG1401BCPZ  [ADG1401BCPZ]
T_+15V  Header_1PIN  [JUMPER1PIN]  (value not drawn)
T_-15V  Header_1PIN  [JUMPER1PIN]  (value not drawn)
T_ESTIM  Header_1PIN  [JUMPER1PIN]  (value not drawn)

### Ports
DAC_CS (in), DAC_SCLK (in), DAC_SDO (in), ESTIM_POW_EN (in), STIM_NULL (in)

### Nets
+15V: AMP1.5(VDDP+) AMP2.8(VDDP+) C67.1 C72.1 C75.1 C78.2 PWR15.1(VOUT1) R40.2 SW1.4(V+) T_+15V.0
+VCoax_5.5V: C68.1 L8.1 L9.1 PWR15.3(VIN)
-15V: AMP1.2(VDDN-) AMP2.5(VDDN-) C65.2 C66.1 C73.1 C76.1 C77.2 D2.2 R38.1 SW1.7(V-) T_-15V.0
GND: AMP2.6(REF) C66.2 C67.2 C68.2 C70.2 C71.2 C72.2 C73.2 C75.2 C76.2 C77.1 C78.1 DAC1.5(GND) PWR15.PAD(GND) R36.1 R39.1 R45.2 R46.1 SW1.3(GND)
VDD33: C70.1 C71.1 DAC1.4(AVDD) R41.2
ESTIM_OUT: AMP2.1(-) R43.2 SW1.1(S) T_ESTIM.0
TEMP: AMP1.4(VOUT) AMP2.4(+) C74.2 R43.1
TEMP2: AMP2.7(VOUT) R42.1
NetAMP1_1: AMP1.1(+P) DAC1.6(VOUT)
NetAMP1_3: AMP1.3(-N) C74.1 R41.1 R42.2
NetAMP2_2: AMP2.2(RG1) R44.1
NetAMP2_3: AMP2.3(RG2) R44.2
NetC65_1: C65.1 PWR15.6(FB2) R37.1 R38.2
NetC69_1: C69.1 D2.1 PWR15.5(D2)
NetC69_2: C69.2 L9.2 PWR15.4(SW2)
NetDAC1_1: DAC1.1(~{SYNC}) ; port DAC_CS
NetDAC1_2: DAC1.2(SCLK) ; port DAC_SCLK
NetDAC1_3: DAC1.3(DIN) ; port DAC_SDO
NetL8_2: L8.2 PWR15.2(SW1)
NetPWR15_7: PWR15.7(VREF) R37.2
NetPWR15_8: PWR15.8(~{SHDN2}) PWR15.9(~{SHDN1}) R39.2 ; port ESTIM_POW_EN
NetPWR15_10: PWR15.10(FB1) R36.2 R40.1
NetR45_1: R45.1 SW1.8(D)
NetR46_2: R46.2 SW1.6(IN) ; port STIM_NULL

Not connected (* = marked no-connect by the designer): SW1 2(NC) 5(NC)

### Library data of the parts
C65-C78 = Cap: Capacitor; Published: 8-Jun-2000; LatestRevisionDate: 17-Jul-2002; LatestRevisionNote: Re-released for DXP Platform.; PackageReference: RAD-0.3; Publisher: Altium Limited; PackageDescription: Radial Cap, Thru-Hole; 2 Leads; 0.3 in Pin Spacing
R36-R46 = Res1: Resistor; Published: 8-Jun-2000; LatestRevisionDate: 17-Jul-2002; LatestRevisionNote: Re-released for DXP Platform.; PackageReference: AXIAL-0.3; Publisher: Altium Limited; PackageDescription: Axial Device, Thru-Hole; 2 Leads; 0.3 in Pin Spacing

## Nets that join several sheets
+VCoax_5.5V: coaxial-port (L5.2), power-supplies (12 pins), led-driver (T_VCoax1.0 T_VCoax2.0), e-stim (C68.1 L8.1 L9.1 PWR15.3)
GND: coaxial-port (C1.1 C2.1 J1.1), power-supplies (26 pins), serial-io (19 pins), led-driver (14 pins), imu (6 pins), e-stim (19 pins)
VDD18: power-supplies (C4.2 L2.2 U10.6), serial-io (10 pins)
VDD33: power-supplies (7 pins), serial-io (6 pins), led-driver (8 pins), imu (5 pins), e-stim (C70.1 C71.1 DAC1.4 R41.2)
NetC18_1: coaxial-port (J1.0 L6.1 R9.2), serial-io (C18.1)
NetDAC1_2: led-driver (LD3.2), e-stim (DAC1.2)
NetDAC1_3: led-driver (LD3.3), e-stim (DAC1.3)